# Altium project US29080671(A).PrjPCB (part 10 of 10)
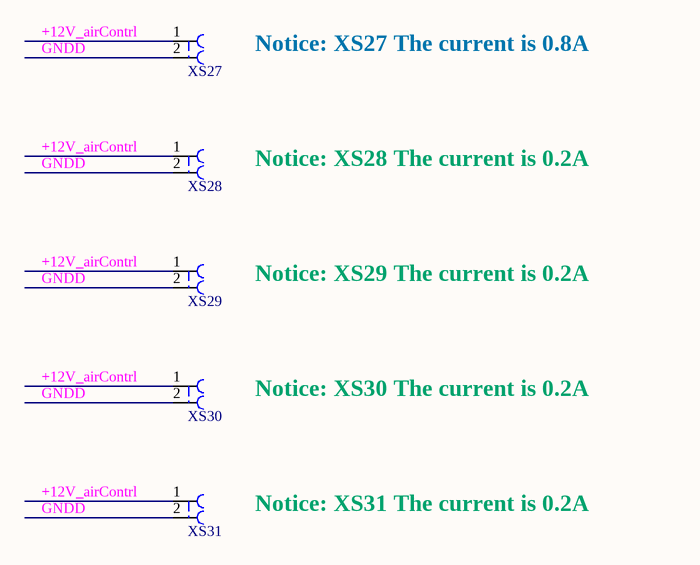
[diagram p44: MY_beamControl_R_风扇供电接口.SchDoc]

## Nets that join several sheets (continued)
D15_A_3: A7_FUNCTION2 (D2.J26), MY_beamControl_R_对内接口 (XS5.43)
D15_A_4: A7_FUNCTION1 (D2.AJ28), MY_beamControl_R_对内接口 (XS7.43)
D15_A_5: A7_FUNCTION2 (D2.AM10), MY_beamControl_R_对内接口 (XS9.43)
D15_A_6: A7_FUNCTION2 (D2.AF2), MY_beamControl_R_对内接口 (XS11.43)
D15_A_7: A7_FUNCTION3 (D2.M2), MY_beamControl_R_对内接口 (XS13.43)
D15_A_8: A7_FUNCTION2 - Ⅱ (D3.J26), MY_beamControl_R_对内接口 (XS15.43)
D15_A_9: A7_FUNCTION1 -Ⅱ (D3.AJ28), MY_beamControl_R_对内接口 (XS17.43)
D15_A_10: A7_FUNCTION2 - Ⅱ (D3.AN6), MY_beamControl_R_对内接口 (XS19.43)
D15_A_11: A7_FUNCTION3 - Ⅱ (D3.M2), MY_beamControl_R_对内接口 (XS21.43)
D15_A_12: A7_FUNCTION3 - Ⅱ (D3.Y6), MY_beamControl_R_对内接口 (XS23.43)
D15_B_1: Z7_FUNCTION3 (D1.P29), MY_beamControl_R_对内接口 (XS1.12)
D15_B_2: Z7_FUNCTION2 (D1.AH17), MY_beamControl_R_对内接口 (XS3.12)
D15_B_3: A7_FUNCTION2 (D2.J23), MY_beamControl_R_对内接口 (XS5.12)
D15_B_4: A7_FUNCTION1 (D2.AF33), MY_beamControl_R_对内接口 (XS7.12)
D15_B_5: A7_FUNCTION1 (D2.AG27), MY_beamControl_R_对内接口 (XS9.12)
D15_B_6: A7_FUNCTION2 (D2.AF4), MY_beamControl_R_对内接口 (XS11.12)
D15_B_7: A7_FUNCTION3 (D2.G4), MY_beamControl_R_对内接口 (XS13.12)
D15_B_8: A7_FUNCTION2 - Ⅱ (D3.J23), MY_beamControl_R_对内接口 (XS15.12)
D15_B_9: A7_FUNCTION1 -Ⅱ (D3.AH34), MY_beamControl_R_对内接口 (XS17.12)
D15_B_10: A7_FUNCTION2 - Ⅱ (D3.AK10), MY_beamControl_R_对内接口 (XS19.12)
D15_B_11: A7_FUNCTION3 - Ⅱ (D3.G4), MY_beamControl_R_对内接口 (XS21.12)
D15_B_12: A7_FUNCTION3 - Ⅱ (D3.W1), MY_beamControl_R_对内接口 (XS23.12)
D15_C_1: Z7_FUNCTION3 (D1.AB26), MY_beamControl_R_对内接口 (XS2.46)
D15_C_2: Z7_FUNCTION2 (D1.AG21), MY_beamControl_R_对内接口 (XS4.46)
D15_C_3: A7_FUNCTION2 (D2.L30), MY_beamControl_R_对内接口 (XS6.46)
D15_C_4: A7_FUNCTION1 (D2.AF32), MY_beamControl_R_对内接口 (XS8.46)
D15_C_5: A7_FUNCTION2 (D2.AM9), MY_beamControl_R_对内接口 (XS10.46)
D15_C_6: A7_FUNCTION2 (D2.AG10), MY_beamControl_R_对内接口 (XS12.46)
D15_C_7: A7_FUNCTION3 (D2.N8), MY_beamControl_R_对内接口 (XS14.46)
D15_C_8: A7_FUNCTION2 - Ⅱ (D3.L30), MY_beamControl_R_对内接口 (XS16.46)
D15_C_9: A7_FUNCTION1 -Ⅱ (D3.AE32), MY_beamControl_R_对内接口 (XS18.46)
D15_C_10: A7_FUNCTION1 -Ⅱ (D3.AK27), MY_beamControl_R_对内接口 (XS20.46)
D15_C_11: A7_FUNCTION3 - Ⅱ (D3.P8), MY_beamControl_R_对内接口 (XS22.46)
D15_C_12: A7_FUNCTION2 - Ⅱ (D3.AJ5), MY_beamControl_R_对内接口 (XS24.46)
D15_D_1: Z7_FUNCTION3 (D1.AG27), MY_beamControl_R_对内接口 (XS2.2)
D15_D_2: Z7_FUNCTION2 (D1.AK17), MY_beamControl_R_对内接口 (XS4.2)
D15_D_3: A7_FUNCTION2 (D2.L33), MY_beamControl_R_对内接口 (XS6.2)
D15_D_4: A7_FUNCTION1 (D2.AN31), MY_beamControl_R_对内接口 (XS8.2)
D15_D_5: A7_FUNCTION2 (D2.AN1), MY_beamControl_R_对内接口 (XS10.2)
D15_D_6: A7_FUNCTION3 (D2.AC1), MY_beamControl_R_对内接口 (XS12.2)
D15_D_7: A7_FUNCTION3 (D2.L4), MY_beamControl_R_对内接口 (XS14.2)
D15_D_8: A7_FUNCTION2 - Ⅱ (D3.L33), MY_beamControl_R_对内接口 (XS16.2)
D15_D_9: A7_FUNCTION1 -Ⅱ (D3.AH32), MY_beamControl_R_对内接口 (XS18.2)
D15_D_10: A7_FUNCTION1 -Ⅱ (D3.AN27), MY_beamControl_R_对内接口 (XS20.2)
D15_D_11: A7_FUNCTION3 - Ⅱ (D3.L4), MY_beamControl_R_对内接口 (XS22.2)
D15_D_12: A7_FUNCTION2 - Ⅱ (D3.AG12), MY_beamControl_R_对内接口 (XS24.2)
D16_A_1: Z7_FUNCTION3 (D1.Y30), MY_beamControl_R_对内接口 (XS1.19)
D16_A_2: Z7_FUNCTION2 (D1.AD15), MY_beamControl_R_对内接口 (XS3.19)
D16_A_3: A7_FUNCTION2 (D2.K25), MY_beamControl_R_对内接口 (XS5.19)
D16_A_4: A7_FUNCTION1 (D2.U30), MY_beamControl_R_对内接口 (XS7.19)
D16_A_5: A7_FUNCTION2 (D2.AP10), MY_beamControl_R_对内接口 (XS9.19)
D16_A_6: A7_FUNCTION3 (D2.W1), MY_beamControl_R_对内接口 (XS11.19)
D16_A_7: A7_FUNCTION3 (D2.P3), MY_beamControl_R_对内接口 (XS13.19)
D16_A_8: A7_FUNCTION2 - Ⅱ (D3.K25), MY_beamControl_R_对内接口 (XS15.19)
D16_A_9: A7_FUNCTION1 -Ⅱ (D3.U30), MY_beamControl_R_对内接口 (XS17.19)
D16_A_10: A7_FUNCTION2 - Ⅱ (D3.AP6), MY_beamControl_R_对内接口 (XS19.19)
D16_A_11: A7_FUNCTION3 - Ⅱ (D3.P3), MY_beamControl_R_对内接口 (XS21.19)
D16_A_12: A7_FUNCTION2 - Ⅱ (D3.AD1), MY_beamControl_R_对内接口 (XS23.19)
D16_B_1: Z7_FUNCTION3 (D1.N28), MY_beamControl_R_对内接口 (XS1.50)
D16_B_2: Z7_FUNCTION2 (D1.AG15), MY_beamControl_R_对内接口 (XS3.50)
D16_B_3: A7_FUNCTION1 (D2.T27), MY_beamControl_R_对内接口 (XS5.50)
D16_B_4: A7_FUNCTION1 (D2.N31), MY_beamControl_R_对内接口 (XS7.50)
D16_B_5: A7_FUNCTION1 (D2.AN29), MY_beamControl_R_对内接口 (XS9.50)
D16_B_6: A7_FUNCTION2 (D2.AK3), MY_beamControl_R_对内接口 (XS11.50)
D16_B_7: A7_FUNCTION3 (D2.F2), MY_beamControl_R_对内接口 (XS13.50)
D16_B_8: A7_FUNCTION1 -Ⅱ (D3.T27), MY_beamControl_R_对内接口 (XS15.50)
D16_B_9: A7_FUNCTION1 -Ⅱ (D3.N31), MY_beamControl_R_对内接口 (XS17.50)
D16_B_10: A7_FUNCTION1 -Ⅱ (D3.AP25), MY_beamControl_R_对内接口 (XS19.50)
D16_B_11: A7_FUNCTION3 - Ⅱ (D3.F2), MY_beamControl_R_对内接口 (XS21.50)
D16_B_12: A7_FUNCTION3 - Ⅱ (D3.AB4), MY_beamControl_R_对内接口 (XS23.50)
D16_C_1: Z7_FUNCTION3 (D1.AG29), MY_beamControl_R_对内接口 (XS2.20)
D16_C_2: Z7_FUNCTION2 (D1.AF20), MY_beamControl_R_对内接口 (XS4.20)
D16_C_3: A7_FUNCTION1 (D2.T28), MY_beamControl_R_对内接口 (XS6.20)
D16_C_4: A7_FUNCTION1 (D2.AG31), MY_beamControl_R_对内接口 (XS8.20)
D16_C_5: A7_FUNCTION1 (D2.AD24), MY_beamControl_R_对内接口 (XS10.20)
D16_C_6: A7_FUNCTION2 (D2.AH9), MY_beamControl_R_对内接口 (XS12.20)
D16_C_7: A7_FUNCTION3 (D2.J9), MY_beamControl_R_对内接口 (XS14.20)
D16_C_8: A7_FUNCTION1 -Ⅱ (D3.T28), MY_beamControl_R_对内接口 (XS16.20)
D16_C_9: A7_FUNCTION1 -Ⅱ (D3.AE28), MY_beamControl_R_对内接口 (XS18.20)
D16_C_10: A7_FUNCTION1 -Ⅱ (D3.AD24), MY_beamControl_R_对内接口 (XS20.20)
D16_C_11: A7_FUNCTION3 - Ⅱ (D3.J9), MY_beamControl_R_对内接口 (XS22.20)
D16_C_12: A7_FUNCTION2 - Ⅱ (D3.AF8), MY_beamControl_R_对内接口 (XS24.20)
D16_D_1: Z7_FUNCTION3 (D1.AE25), MY_beamControl_R_对内接口 (XS2.39)
D16_D_2: Z7_FUNCTION2 (D1.AJ18), MY_beamControl_R_对内接口 (XS4.39)
D16_D_3: A7_FUNCTION1 (D2.N32), MY_beamControl_R_对内接口 (XS6.39)
D16_D_4: A7_FUNCTION1 (D2.AK30), MY_beamControl_R_对内接口 (XS8.39)
D16_D_5: A7_FUNCTION2 (D2.AK6), MY_beamControl_R_对内接口 (XS10.39)
D16_D_6: A7_FUNCTION2 (D2.AJ4), MY_beamControl_R_对内接口 (XS12.39)
D16_D_7: A7_FUNCTION3 (D2.J11), MY_beamControl_R_对内接口 (XS14.39)
D16_D_8: A7_FUNCTION1 -Ⅱ (D3.N32), MY_beamControl_R_对内接口 (XS16.39)
D16_D_9: A7_FUNCTION1 -Ⅱ (D3.AL30), MY_beamControl_R_对内接口 (XS18.39)
D16_D_10: A7_FUNCTION2 - Ⅱ (D3.AK11), MY_beamControl_R_对内接口 (XS20.39)
D16_D_11: A7_FUNCTION3 - Ⅱ (D3.M4), MY_beamControl_R_对内接口 (XS22.39)
D16_D_12: A7_FUNCTION2 - Ⅱ (D3.AG4), MY_beamControl_R_对内接口 (XS24.39)
DDR_A0: Z7_BANK_DDR3 (D1.L25 R143.1), Z7_DDR3 (D9.N3 D10.N3)
DDR_A1: Z7_BANK_DDR3 (D1.K26 R144.1), Z7_DDR3 (D9.P7 D10.P7)
DDR_A2: Z7_BANK_DDR3 (D1.L27 R145.1), Z7_DDR3 (D9.P3 D10.P3)
DDR_A3: Z7_BANK_DDR3 (D1.G25 R146.1), Z7_DDR3 (D9.N2 D10.N2)
DDR_A4: Z7_BANK_DDR3 (D1.J26 R147.1), Z7_DDR3 (D9.P8 D10.P8)
DDR_A5: Z7_BANK_DDR3 (D1.G24 R148.1), Z7_DDR3 (D9.P2 D10.P2)
DDR_A6: Z7_BANK_DDR3 (D1.H26 R149.1), Z7_DDR3 (D9.R8 D10.R8)
DDR_A7: Z7_BANK_DDR3 (D1.K22 R150.1), Z7_DDR3 (D9.R2 D10.R2)
DDR_A8: Z7_BANK_DDR3 (D1.F27 R151.1), Z7_DDR3 (D9.T8 D10.T8)
DDR_A9: Z7_BANK_DDR3 (D1.J23 R152.1), Z7_DDR3 (D9.R3 D10.R3)
DDR_A10: Z7_BANK_DDR3 (D1.G26 R153.1), Z7_DDR3 (D9.L7 D10.L7)
DDR_A11: Z7_BANK_DDR3 (D1.H24 R154.1), Z7_DDR3 (D9.R7 D10.R7)
DDR_A12: Z7_BANK_DDR3 (D1.K23 R155.1), Z7_DDR3 (D9.N7 D10.N7)
DDR_A13: Z7_BANK_DDR3 (D1.H23 R156.1), Z7_DDR3 (D9.T3 D10.T3)
DDR_A14: Z7_BANK_DDR3 (D1.J24 R157.1), Z7_DDR3 (D9.T7 D10.T7)
DDR_BA0: Z7_BANK_DDR3 (D1.M27 R159.1), Z7_DDR3 (D9.M2 D10.M2)
DDR_BA1: Z7_BANK_DDR3 (D1.M26 R160.1), Z7_DDR3 (D9.N8 D10.N8)
DDR_BA2: Z7_BANK_DDR3 (D1.M25 R161.1), Z7_DDR3 (D9.M3 D10.M3)
DDR_CAS_N: Z7_BANK_DDR3 (D1.M24 R163.1), Z7_DDR3 (D9.K3 D10.K3)
DDR_CKE: Z7_BANK_DDR3 (D1.M22 R165.1 R350.2), Z7_DDR3 (D9.K9 D10.K9)
DDR_CLKN: Z7_BANK_DDR3 (D1.J25), Z7_DDR3 (D9.K7 D10.K7 R175.1)
DDR_CLKP: Z7_BANK_DDR3 (D1.K25), Z7_DDR3 (D9.J7 D10.J7 R175.2)
DDR_CS_N: Z7_BANK_DDR3 (D1.N22 R169.1), Z7_DDR3 (D9.L2 D10.L2)
DDR_DQ0: Z7_BANK_DDR3 (D1.A25), Z7_DDR3 (D10.E3)
DDR_DQ1: Z7_BANK_DDR3 (D1.E25), Z7_DDR3 (D10.F7)
DDR_DQ2: Z7_BANK_DDR3 (D1.B27), Z7_DDR3 (D10.F2)
DDR_DQ3: Z7_BANK_DDR3 (D1.D25), Z7_DDR3 (D10.F8)
DDR_DQ4: Z7_BANK_DDR3 (D1.B25), Z7_DDR3 (D10.H3)
DDR_DQ5: Z7_BANK_DDR3 (D1.E26), Z7_DDR3 (D10.H8)
DDR_DQ6: Z7_BANK_DDR3 (D1.D26), Z7_DDR3 (D10.G2)
DDR_DQ7: Z7_BANK_DDR3 (D1.E27), Z7_DDR3 (D10.H7)
DDR_DQ8: Z7_BANK_DDR3 (D1.A29), Z7_DDR3 (D10.D7)
DDR_DQ9: Z7_BANK_DDR3 (D1.A27), Z7_DDR3 (D10.C3)
DDR_DQ10: Z7_BANK_DDR3 (D1.A30), Z7_DDR3 (D10.C8)
DDR_DQ11: Z7_BANK_DDR3 (D1.A28), Z7_DDR3 (D10.C2)
DDR_DQ12: Z7_BANK_DDR3 (D1.C28), Z7_DDR3 (D10.A7)
DDR_DQ13: Z7_BANK_DDR3 (D1.D30), Z7_DDR3 (D10.A2)
DDR_DQ14: Z7_BANK_DDR3 (D1.D28), Z7_DDR3 (D10.B8)
DDR_DQ15: Z7_BANK_DDR3 (D1.D29), Z7_DDR3 (D10.A3)
DDR_DQ16: Z7_BANK_DDR3 (D1.H27), Z7_DDR3 (D9.E3)
DDR_DQ17: Z7_BANK_DDR3 (D1.G27), Z7_DDR3 (D9.F7)
DDR_DQ18: Z7_BANK_DDR3 (D1.H28), Z7_DDR3 (D9.F2)
DDR_DQ19: Z7_BANK_DDR3 (D1.E28), Z7_DDR3 (D9.F8)
DDR_DQ20: Z7_BANK_DDR3 (D1.E30), Z7_DDR3 (D9.H3)
DDR_DQ21: Z7_BANK_DDR3 (D1.F28), Z7_DDR3 (D9.H8)
DDR_DQ22: Z7_BANK_DDR3 (D1.G30), Z7_DDR3 (D9.G2)
DDR_DQ23: Z7_BANK_DDR3 (D1.F30), Z7_DDR3 (D9.H7)
DDR_DQ24: Z7_BANK_DDR3 (D1.J29), Z7_DDR3 (D9.D7)
DDR_DQ25: Z7_BANK_DDR3 (D1.K27), Z7_DDR3 (D9.C3)
DDR_DQ26: Z7_BANK_DDR3 (D1.J30), Z7_DDR3 (D9.C8)
DDR_DQ27: Z7_BANK_DDR3 (D1.J28), Z7_DDR3 (D9.C2)
DDR_DQ28: Z7_BANK_DDR3 (D1.K30), Z7_DDR3 (D9.A7)
DDR_DQ29: Z7_BANK_DDR3 (D1.M29), Z7_DDR3 (D9.A2)
DDR_DQ30: Z7_BANK_DDR3 (D1.L30), Z7_DDR3 (D9.B8)
DDR_DQ31: Z7_BANK_DDR3 (D1.M30), Z7_DDR3 (D9.A3)
DDR_DQM0: Z7_BANK_DDR3 (D1.C27), Z7_DDR3 (D10.E7)
DDR_DQM1: Z7_BANK_DDR3 (D1.B30), Z7_DDR3 (D10.D3)
DDR_DQM2: Z7_BANK_DDR3 (D1.H29), Z7_DDR3 (D9.E7)
DDR_DQM3: Z7_BANK_DDR3 (D1.K28), Z7_DDR3 (D9.D3)
DDR_DQSN0: Z7_BANK_DDR3 (D1.B26), Z7_DDR3 (D10.G3)
DDR_DQSN1: Z7_BANK_DDR3 (D1.B29), Z7_DDR3 (D10.B7)
DDR_DQSN2: Z7_BANK_DDR3 (D1.F29), Z7_DDR3 (D9.G3)
DDR_DQSN3: Z7_BANK_DDR3 (D1.L29), Z7_DDR3 (D9.B7)
DDR_DQSP0: Z7_BANK_DDR3 (D1.C26), Z7_DDR3 (D10.F3)
DDR_DQSP1: Z7_BANK_DDR3 (D1.C29), Z7_DDR3 (D10.C7)
DDR_DQSP2: Z7_BANK_DDR3 (D1.G29), Z7_DDR3 (D9.F3)
DDR_DQSP3: Z7_BANK_DDR3 (D1.L28), Z7_DDR3 (D9.C7)
DDR_ODT: Z7_BANK_DDR3 (D1.L23 R167.1), Z7_DDR3 (D9.K1 D10.K1)
DDR_RAS_N: Z7_BANK_DDR3 (D1.N24 R162.1), Z7_DDR3 (D9.J3 D10.J3)
DDR_RESET_N: Z7_BANK_DDR3 (D1.F25 R158.2 R168.1), Z7_DDR3 (D9.T2 D10.T2)
DDR_WE_N: Z7_BANK_DDR3 (D1.N23 R170.1), Z7_DDR3 (D9.L3 D10.L3)
EMMC_RST_N: Z7_STORAGE (D19.U5 R274.2), Z7_FUNCTION1 (D1.F7)
ENET0_INT: Z7_ETHERNET (D11.5 R183.1), Z7_FUNCTION3 (D1.P21)
ENET0_MDC: Z7_BANK500_501 (D1.D19), Z7_ETHERNET (D23.4 R288.1)
ENET0_MDIO: Z7_BANK500_501 (D1.C18), Z7_ETHERNET (D23.5 R287.1)
ENET0_PHY_RSTN: Z7_ETHERNET (R182.1), Z7_FUNCTION3 (D1.R21)
ENET0_RX_CLK: Z7_BANK500_501 (D1.L20), Z7_ETHERNET (R192.1 R339.1)
ENET0_RX_CTL: Z7_BANK500_501 (D1.G20), Z7_ETHERNET (R195.1 R344.1)
ENET0_RXD0: Z7_BANK500_501 (D1.J21), Z7_ETHERNET (R188.1 R340.1)
ENET0_RXD1: Z7_BANK500_501 (D1.M19), Z7_ETHERNET (R189.1 R341.1)
ENET0_RXD2: Z7_BANK500_501 (D1.G19), Z7_ETHERNET (R190.1 R342.1)
ENET0_RXD3: Z7_BANK500_501 (D1.M17), Z7_ETHERNET (R191.1 R343.1)
ENET0_TX_CLK: Z7_BANK500_501 (D1.L19), Z7_ETHERNET (R176.1)
ENET0_TX_CTL: Z7_BANK500_501 (D1.J19), Z7_ETHERNET (R338.1)
ENET0_TXD0: Z7_BANK500_501 (D1.K21), Z7_ETHERNET (R251.1)
ENET0_TXD1: Z7_BANK500_501 (D1.K20), Z7_ETHERNET (R253.1)
ENET0_TXD2: Z7_BANK500_501 (D1.J20), Z7_ETHERNET (R317.1)
ENET0_TXD3: Z7_BANK500_501 (D1.M20), Z7_ETHERNET (R337.1)
FPGA0_CFG_RW: A7_JTAG&CONFIG (D2.AC33), Z7_FUNCTION2 (D1.AC22)
FPGA0_CSI_N: A7_JTAG&CONFIG (D2.AA32), Z7_FUNCTION2 (D1.AC23)
FPGA0_DONE: A7_JTAG&CONFIG (D2.P11 R13.1), Z7_FUNCTION2 (D1.AA23)
FPGA0_INIT_N: A7_JTAG&CONFIG (D2.V11 R324.1), Z7_FUNCTION2 (D1.AA22)
FPGA0_PRG_N: A7_JTAG&CONFIG (D2.N11 R325.1), Z7_FUNCTION2 (D1.AB24)
FPGA0_RST: A7_FUNCTION2 (D2.AK7), Z7_FUNCTION2 (D1.AC13)
FPGA0_TDI_R: A7_JTAG&CONFIG (D2.AE14), Z7_BLOCK (R292.1), Z7_JTAG&DEBUG (R302.1)
FPGA0_TDO: A7_JTAG&CONFIG (D2.AD13 R296.2), Z7_BLOCK (R295.1)
FPGA1_CCLK: A7_JTAG&CONFIG - Ⅱ (D3.W11), Z7_FUNCTION2 (D1.AH13)
FPGA1_CFG_RW: A7_JTAG&CONFIG - Ⅱ (D3.AC33), Z7_FUNCTION3 (D1.AK26)
FPGA1_CSI_N: A7_JTAG&CONFIG - Ⅱ (D3.AA32), Z7_FUNCTION3 (D1.AA25)
FPGA1_DONE: A7_JTAG&CONFIG - Ⅱ (D3.P11 R9.1), Z7_FUNCTION3 (D1.AJ26)
FPGA1_INIT_N: A7_JTAG&CONFIG - Ⅱ (D3.V11 R326.1), Z7_FUNCTION3 (D1.AH27)
FPGA1_PRG_N: A7_JTAG&CONFIG - Ⅱ (D3.N11 R327.1), Z7_FUNCTION3 (D1.AH26)
FPGA1_RST: A7_FUNCTION2 - Ⅱ (D3.AD6), Z7_FUNCTION2 (D1.AA15)
FPGA1_TDI_R: A7_JTAG&CONFIG (R296.1), A7_JTAG&CONFIG - Ⅱ (D3.AE14), Z7_BLOCK (R293.1)
FPGA1_TDO: A7_JTAG&CONFIG - Ⅱ (D3.AD13), Z7_BLOCK (R303.1)
FPGA_CCLK: A7_JTAG&CONFIG (D2.W11), Z7_FUNCTION2 (D1.AC21)
FPGA_CFG_D0: A7_JTAG&CONFIG (D2.V28), A7_JTAG&CONFIG - Ⅱ (D3.V28), Z7_FUNCTION2 (D1.AA17)
FPGA_CFG_D1: A7_JTAG&CONFIG (D2.V29), A7_JTAG&CONFIG - Ⅱ (D3.V29), Z7_FUNCTION2 (D1.AB16)
FPGA_CFG_D2: A7_JTAG&CONFIG (D2.V26), A7_JTAG&CONFIG - Ⅱ (D3.V26), Z7_FUNCTION2 (D1.AB17)
FPGA_CFG_D3: A7_JTAG&CONFIG (D2.V27), A7_JTAG&CONFIG - Ⅱ (D3.V27), Z7_FUNCTION2 (D1.AC16)
FPGA_CFG_D4: A7_JTAG&CONFIG (D2.W28), A7_JTAG&CONFIG - Ⅱ (D3.W28), Z7_FUNCTION2 (D1.AC17)
FPGA_CFG_D5: A7_JTAG&CONFIG (D2.W29), A7_JTAG&CONFIG - Ⅱ (D3.W29), Z7_FUNCTION2 (D1.AB14)
FPGA_CFG_D6: A7_JTAG&CONFIG (D2.W25), A7_JTAG&CONFIG - Ⅱ (D3.W25), Z7_FUNCTION2 (D1.AB15)
FPGA_CFG_D7: A7_JTAG&CONFIG (D2.Y25), A7_JTAG&CONFIG - Ⅱ (D3.Y25), Z7_FUNCTION2 (D1.AC12)
JC_RS422_TX+: Z7_FUNCTION2 (D12.9 R200.2), MY_beamControl_R_对外接口 (XS26.4)
JC_RS422_TX-: Z7_FUNCTION2 (D12.10 R200.1), MY_beamControl_R_对外接口 (XS26.5)
JTAG_TCK: A7_JTAG&CONFIG (D2.AE12), A7_JTAG&CONFIG - Ⅱ (D3.AE12), Z7_BLOCK (JTAG1.6), Z7_JTAG&DEBUG (D1.Y12 R209.2)
JTAG_TMS: A7_JTAG&CONFIG (D2.AE13), A7_JTAG&CONFIG - Ⅱ (D3.AE13), Z7_BLOCK (JTAG1.4), Z7_JTAG&DEBUG (D1.V10 R208.2)
KZ_RS422_RX+: Z7_FUNCTION2 (D12.11), MY_beamControl_R_对外接口 (XS26.8)
KZ_RS422_RX-: Z7_FUNCTION2 (D12.12), MY_beamControl_R_对外接口 (XS26.9)
LD_A_1: Z7_FUNCTION3 (D1.W26), MY_beamControl_R_对内接口 (XS1.28)
LD_A_2: Z7_FUNCTION2 (D1.AE17), MY_beamControl_R_对内接口 (XS3.28)
LD_A_3: A7_FUNCTION2 (D2.K28), MY_beamControl_R_对内接口 (XS5.28)
LD_A_4: A7_FUNCTION1 (D2.AD28), MY_beamControl_R_对内接口 (XS7.28)
LD_A_5: A7_FUNCTION2 (D2.AN7), MY_beamControl_R_对内接口 (XS9.28)
LD_A_6: A7_FUNCTION3 (D2.AC2), MY_beamControl_R_对内接口 (XS11.28)
LD_A_7: A7_FUNCTION3 (D2.R2), MY_beamControl_R_对内接口 (XS13.28)
LD_A_8: A7_FUNCTION2 - Ⅱ (D3.K28), MY_beamControl_R_对内接口 (XS15.28)
LD_A_9: A7_FUNCTION1 -Ⅱ (D3.AM32), MY_beamControl_R_对内接口 (XS17.28)
LD_A_10: A7_FUNCTION2 - Ⅱ (D3.AN2), MY_beamControl_R_对内接口 (XS19.28)
LD_A_11: A7_FUNCTION3 - Ⅱ (D3.P1), MY_beamControl_R_对内接口 (XS21.28)
LD_A_12: A7_FUNCTION3 - Ⅱ (D3.V7), MY_beamControl_R_对内接口 (XS23.28)
LD_B_1: Z7_FUNCTION3 (D1.U29), MY_beamControl_R_对内接口 (XS1.22)
LD_B_2: Z7_FUNCTION2 (D1.AJ15), MY_beamControl_R_对内接口 (XS3.22)
LD_B_3: A7_FUNCTION1 (D2.R25), MY_beamControl_R_对内接口 (XS5.22)
LD_B_4: A7_FUNCTION1 (D2.U34), MY_beamControl_R_对内接口 (XS7.22)
LD_B_5: A7_FUNCTION1 (D2.AM27), MY_beamControl_R_对内接口 (XS9.22)
LD_B_6: A7_FUNCTION3 (D2.AA3), MY_beamControl_R_对内接口 (XS11.22)
LD_B_7: A7_FUNCTION3 (D2.L3), MY_beamControl_R_对内接口 (XS13.22)
LD_B_8: A7_FUNCTION1 -Ⅱ (D3.R25), MY_beamControl_R_对内接口 (XS15.22)
LD_B_9: A7_FUNCTION1 -Ⅱ (D3.AL34), MY_beamControl_R_对内接口 (XS17.22)
LD_B_10: A7_FUNCTION2 - Ⅱ (D3.AK8), MY_beamControl_R_对内接口 (XS19.22)
LD_B_11: A7_FUNCTION3 - Ⅱ (D3.L3), MY_beamControl_R_对内接口 (XS21.22)
LD_B_12: A7_FUNCTION3 - Ⅱ (D3.AB1), MY_beamControl_R_对内接口 (XS23.22)
LD_C_1: Z7_FUNCTION3 (D1.T25), MY_beamControl_R_对内接口 (XS2.36)
LD_C_2: Z7_FUNCTION2 (D1.AF22), MY_beamControl_R_对内接口 (XS4.36)
LD_C_3: A7_FUNCTION2 (D2.H31), MY_beamControl_R_对内接口 (XS6.36)
LD_C_4: A7_FUNCTION1 (D2.AE32), MY_beamControl_R_对内接口 (XS8.36)
LD_C_5: A7_FUNCTION2 (D2.AJ11), MY_beamControl_R_对内接口 (XS10.36)
LD_C_6: A7_FUNCTION2 (D2.AE11), MY_beamControl_R_对内接口 (XS12.36)
LD_C_7: A7_FUNCTION3 (D2.P5), MY_beamControl_R_对内接口 (XS14.36)
LD_C_8: A7_FUNCTION2 - Ⅱ (D3.H31), MY_beamControl_R_对内接口 (XS16.36)
LD_C_9: A7_FUNCTION1 -Ⅱ (D3.AC26), MY_beamControl_R_对内接口 (XS18.36)
LD_C_10: A7_FUNCTION1 -Ⅱ (D3.AH27), MY_beamControl_R_对内接口 (XS20.36)
LD_C_11: A7_FUNCTION3 - Ⅱ (D3.K11), MY_beamControl_R_对内接口 (XS22.36)
LD_C_12: A7_FUNCTION2 - Ⅱ (D3.AG2), MY_beamControl_R_对内接口 (XS24.36)
LD_D_1: Z7_FUNCTION3 (D1.AK30), MY_beamControl_R_对内接口 (XS2.17)
LD_D_2: Z7_FUNCTION2 (D1.AH18), MY_beamControl_R_对内接口 (XS4.17)
LD_D_3: A7_FUNCTION1 (D2.U25), MY_beamControl_R_对内接口 (XS6.17)
LD_D_4: A7_FUNCTION1 (D2.AM31), MY_beamControl_R_对内接口 (XS8.17)
LD_D_5: A7_FUNCTION2 (D2.AN4), MY_beamControl_R_对内接口 (XS10.17)
LD_D_6: A7_FUNCTION2 (D2.AH1), MY_beamControl_R_对内接口 (XS12.17)
LD_D_7: A7_FUNCTION3 (D2.H7), MY_beamControl_R_对内接口 (XS14.17)
LD_D_8: A7_FUNCTION1 -Ⅱ (D3.U25), MY_beamControl_R_对内接口 (XS16.17)
LD_D_9: A7_FUNCTION1 -Ⅱ (D3.AG31), MY_beamControl_R_对内接口 (XS18.17)
LD_D_10: A7_FUNCTION1 -Ⅱ (D3.AN29), MY_beamControl_R_对内接口 (XS20.17)
LD_D_11: A7_FUNCTION3 - Ⅱ (D3.H7), MY_beamControl_R_对内接口 (XS22.17)
LD_D_12: A7_FUNCTION2 - Ⅱ (D3.AH9), MY_beamControl_R_对内接口 (XS24.17)
POW_SYS_PG: POWER_B3 (D6.6 R105.1), ZYNQ_reset (D26.1)
PS_POR_N: Z7_BANK500_501 (C269.1 D1.D21 R131.1 R140.2), Z7_FUNCTION1 (D1.J3), ZYNQ_reset (D26.4)
PS_SRST_N: Z7_BANK500_501 (D1.B19 R130.1), Z7_FUNCTION1 (D1.H9)
QSPI0_0: Z7_BANK500_501 (D1.F23 R139.2), Z7_STORAGE (D16.5)
QSPI0_1: Z7_BANK500_501 (D1.C23 R138.2), Z7_STORAGE (D16.2)
QSPI0_2: Z7_BANK500_501 (D1.E23 R4.1 R137.2), Z7_STORAGE (D16.3)
QSPI0_3: Z7_BANK500_501 (D1.C24 R5.1), Z7_STORAGE (D16.7)
QSPI0_SCLK: Z7_BANK500_501 (D1.D24 R136.2), Z7_STORAGE (D16.6)
QSPI0_SS_B: Z7_BANK500_501 (D1.D23), Z7_STORAGE (D16.1)
QSPI1_0: Z7_BANK500_501 (D1.E22), Z7_STORAGE (D18.5)
QSPI1_1: Z7_BANK500_501 (D1.A23), Z7_STORAGE (D18.2)
QSPI1_2: Z7_BANK500_501 (D1.E21), Z7_STORAGE (D18.3)
QSPI1_3: Z7_BANK500_501 (D1.F22), Z7_STORAGE (D18.7)
QSPI1_SCLK: Z7_BANK500_501 (D1.A24), Z7_STORAGE (D18.6)
QSPI1_SS_B: Z7_BANK500_501 (D1.F24), Z7_STORAGE (D18.1)
RX1: Z7_FUNCTION2 (D1.AC24), MY_beamControl_R_对外接口 (D24.2)
SD0_CLK: Z7_BANK500_501 (D1.B20), Z7_STORAGE (D17.9)
SD0_CMD: Z7_BANK500_501 (D1.J18), Z7_STORAGE (D17.4)
SD0_DATA0: Z7_BANK500_501 (D1.D20), Z7_STORAGE (D17.6)
SD0_DATA1: Z7_BANK500_501 (D1.E18), Z7_STORAGE (D17.7)
SD0_DATA2: Z7_BANK500_501 (D1.E20), Z7_STORAGE (D17.1)
SD0_DATA3: Z7_BANK500_501 (D1.H18), Z7_STORAGE (D17.3)
SD0_SEL: Z7_STORAGE (D17.24 R260.1 R261.2), Z7_FUNCTION1 (D1.J4)
SD1_CLK: Z7_BANK500_501 (D1.C19), Z7_STORAGE (R272.1)
SD1_CMD: Z7_BANK500_501 (D1.A18), Z7_STORAGE (R273.1)
SD1_DATA0: Z7_BANK500_501 (D1.F20), Z7_STORAGE (R262.1)
SD1_DATA1: Z7_BANK500_501 (D1.D18), Z7_STORAGE (R264.1)
SD1_DATA2: Z7_BANK500_501 (D1.A19), Z7_STORAGE (R266.1)
SD1_DATA3: Z7_BANK500_501 (D1.F19), Z7_STORAGE (R268.1)
SUBA1_DLY0: Z7_FUNCTION1 (D1.L3), MY_beamControl_R电平转换 (U1.C5)
SUBA1_DLY1: Z7_FUNCTION1 (D1.K2), MY_beamControl_R电平转换 (U1.B6)
SUBA1_DLY2: Z7_FUNCTION1 (D1.K3), MY_beamControl_R电平转换 (U1.B5)
SUBA1_DLY_5V0: MY_beamControl_R_对内接口 (XS2.50), MY_beamControl_R电平转换 (U1.C2)
SUBA1_DLY_5V1: MY_beamControl_R_对内接口 (XS2.33), MY_beamControl_R电平转换 (U1.B1)
SUBA1_DLY_5V2: MY_beamControl_R_对内接口 (XS2.6), MY_beamControl_R电平转换 (U1.B2)
SUBA2_DLY0: Z7_FUNCTION1 (D1.J5), MY_beamControl_R电平转换 (U1.D6)
SUBA2_DLY1: Z7_FUNCTION1 (D1.K5), MY_beamControl_R电平转换 (U1.D5)
SUBA2_DLY2: Z7_FUNCTION1 (D1.L2), MY_beamControl_R电平转换 (U1.C6)
SUBA2_DLY_5V0: MY_beamControl_R_对内接口 (XS4.50), MY_beamControl_R电平转换 (U1.D1)
SUBA2_DLY_5V1: MY_beamControl_R_对内接口 (XS4.33), MY_beamControl_R电平转换 (U1.D2)
SUBA2_DLY_5V2: MY_beamControl_R_对内接口 (XS4.6), MY_beamControl_R电平转换 (U1.C1)
SUBA3_DLY0: Z7_FUNCTION1 (D1.G2), MY_beamControl_R电平转换 (U1.F6)
SUBA3_DLY1: Z7_FUNCTION1 (D1.J6), MY_beamControl_R电平转换 (U1.E6)
SUBA3_DLY2: Z7_FUNCTION1 (D1.K6), MY_beamControl_R电平转换 (U1.E5)
SUBA3_DLY_5V0: MY_beamControl_R_对内接口 (XS6.50), MY_beamControl_R电平转换 (U1.F1)
SUBA3_DLY_5V1: MY_beamControl_R_对内接口 (XS6.33), MY_beamControl_R电平转换 (U1.E1)
SUBA3_DLY_5V2: MY_beamControl_R_对内接口 (XS6.6), MY_beamControl_R电平转换 (U1.E2)
SUBA4_DLY0: Z7_FUNCTION1 (D1.G6), MY_beamControl_R电平转换 (U1.G5)
SUBA4_DLY1: Z7_FUNCTION1 (D1.H6), MY_beamControl_R电平转换 (U1.G6)
SUBA4_DLY2: Z7_FUNCTION1 (D1.F2), MY_beamControl_R电平转换 (U1.F5)
SUBA4_DLY_5V0: MY_beamControl_R_对内接口 (XS8.50), MY_beamControl_R电平转换 (U1.G2)
SUBA4_DLY_5V1: MY_beamControl_R_对内接口 (XS8.33), MY_beamControl_R电平转换 (U1.G1)
SUBA4_DLY_5V2: MY_beamControl_R_对内接口 (XS8.6), MY_beamControl_R电平转换 (U1.F2)
SUBA5_DLY0: Z7_FUNCTION1 (D1.H2), MY_beamControl_R电平转换 (U1.J6)
SUBA5_DLY1: Z7_FUNCTION1 (D1.H1), MY_beamControl_R电平转换 (U1.H5)
SUBA5_DLY2: Z7_FUNCTION1 (D1.J1), MY_beamControl_R电平转换 (U1.H6)
SUBA5_DLY_5V0: MY_beamControl_R_对内接口 (XS10.50), MY_beamControl_R电平转换 (U1.J1)
SUBA5_DLY_5V1: MY_beamControl_R_对内接口 (XS10.33), MY_beamControl_R电平转换 (U1.H2)
SUBA5_DLY_5V2: MY_beamControl_R_对内接口 (XS10.6), MY_beamControl_R电平转换 (U1.H1)
SUBA6_DLY0: Z7_FUNCTION1 (D1.D5), MY_beamControl_R电平转换 (U3.C5)
SUBA6_DLY1: Z7_FUNCTION1 (D1.E6), MY_beamControl_R电平转换 (U3.B6)
SUBA6_DLY2: Z7_FUNCTION1 (D1.G1), MY_beamControl_R电平转换 (U3.B5)
SUBA6_DLY_5V0: MY_beamControl_R_对内接口 (XS12.50), MY_beamControl_R电平转换 (U3.C2)
SUBA6_DLY_5V1: MY_beamControl_R_对内接口 (XS12.33), MY_beamControl_R电平转换 (U3.B1)
SUBA6_DLY_5V2: MY_beamControl_R_对内接口 (XS12.6), MY_beamControl_R电平转换 (U3.B2)
SUBA7_DLY0: Z7_FUNCTION1 (D1.E3), MY_beamControl_R电平转换 (U3.D6)
SUBA7_DLY1: Z7_FUNCTION1 (D1.D3), MY_beamControl_R电平转换 (U3.D5)
SUBA7_DLY2: Z7_FUNCTION1 (D1.D4), MY_beamControl_R电平转换 (U3.C6)
SUBA7_DLY_5V0: MY_beamControl_R_对内接口 (XS14.50), MY_beamControl_R电平转换 (U3.D1)
SUBA7_DLY_5V1: MY_beamControl_R_对内接口 (XS14.33), MY_beamControl_R电平转换 (U3.D2)
SUBA7_DLY_5V2: MY_beamControl_R_对内接口 (XS14.6), MY_beamControl_R电平转换 (U3.C1)
SUBA8_DLY0: Z7_FUNCTION1 (D1.D1), MY_beamControl_R电平转换 (U3.F6)
SUBA8_DLY1: Z7_FUNCTION1 (D1.E1), MY_beamControl_R电平转换 (U3.E6)
SUBA8_DLY2: Z7_FUNCTION1 (D1.E2), MY_beamControl_R电平转换 (U3.E5)
SUBA8_DLY_5V0: MY_beamControl_R_对内接口 (XS16.50), MY_beamControl_R电平转换 (U3.F1)
SUBA8_DLY_5V1: MY_beamControl_R_对内接口 (XS16.33), MY_beamControl_R电平转换 (U3.E1)
SUBA8_DLY_5V2: MY_beamControl_R_对内接口 (XS16.6), MY_beamControl_R电平转换 (U3.E2)
SUBA9_DLY0: Z7_FUNCTION1 (D1.B5), MY_beamControl_R电平转换 (U3.G5)
SUBA9_DLY1: Z7_FUNCTION1 (D1.C3), MY_beamControl_R电平转换 (U3.G6)
SUBA9_DLY2: Z7_FUNCTION1 (D1.C4), MY_beamControl_R电平转换 (U3.F5)
SUBA9_DLY_5V0: MY_beamControl_R_对内接口 (XS18.50), MY_beamControl_R电平转换 (U3.G2)
SUBA9_DLY_5V1: MY_beamControl_R_对内接口 (XS18.33), MY_beamControl_R电平转换 (U3.G1)
SUBA9_DLY_5V2: MY_beamControl_R_对内接口 (XS18.6), MY_beamControl_R电平转换 (U3.F2)
SUBA10_DLY0: Z7_FUNCTION1 (D1.A4), MY_beamControl_R电平转换 (U3.J6)
SUBA10_DLY1: Z7_FUNCTION1 (D1.A5), MY_beamControl_R电平转换 (U3.H5)
SUBA10_DLY2: Z7_FUNCTION1 (D1.B4), MY_beamControl_R电平转换 (U3.H6)
SUBA10_DLY_5V0: MY_beamControl_R_对内接口 (XS20.50), MY_beamControl_R电平转换 (U3.J1)
SUBA10_DLY_5V1: MY_beamControl_R_对内接口 (XS20.33), MY_beamControl_R电平转换 (U3.H2)
SUBA10_DLY_5V2: MY_beamControl_R_对内接口 (XS20.6), MY_beamControl_R电平转换 (U3.H1)
SUBA11_DLY0: Z7_FUNCTION1 (D1.B2), MY_beamControl_R电平转换 (U4.C5)
SUBA11_DLY1: Z7_FUNCTION1 (D1.C1), MY_beamControl_R电平转换 (U4.B6)
SUBA11_DLY2: Z7_FUNCTION1 (D1.C2), MY_beamControl_R电平转换 (U4.B5)
SUBA11_DLY_5V0: MY_beamControl_R_对内接口 (XS22.50), MY_beamControl_R电平转换 (U4.C2)
SUBA11_DLY_5V1: MY_beamControl_R_对内接口 (XS22.33), MY_beamControl_R电平转换 (U4.B1)
SUBA11_DLY_5V2: MY_beamControl_R_对内接口 (XS22.6), MY_beamControl_R电平转换 (U4.B2)
SUBA12_DLY0: Z7_FUNCTION1 (D1.A2), MY_beamControl_R电平转换 (U4.D6)
SUBA12_DLY1: Z7_FUNCTION1 (D1.A3), MY_beamControl_R电平转换 (U4.D5)
SUBA12_DLY2: Z7_FUNCTION1 (D1.B1), MY_beamControl_R电平转换 (U4.C6)
SUBA12_DLY_5V0: MY_beamControl_R_对内接口 (XS24.50), MY_beamControl_R电平转换 (U4.D1)
SUBA12_DLY_5V1: MY_beamControl_R_对内接口 (XS24.33), MY_beamControl_R电平转换 (U4.D2)
SUBA12_DLY_5V2: MY_beamControl_R_对内接口 (XS24.6), MY_beamControl_R电平转换 (U4.C1)
TX1: Z7_FUNCTION2 (D1.W23), MY_beamControl_R_对外接口 (D24.5)
UART0_RX: Z7_JTAG&DEBUG (CN17.2 R213.2 U7.25), Z7_BANK500_501 (D1.B22)
UART0_TX: Z7_JTAG&DEBUG (CN17.3 R214.2 U7.24), Z7_BANK500_501 (D1.C22)
USB0_CLK: Z7_USB (D20.1), Z7_BANK500_501 (D1.H17)
USB0_DATA0: Z7_USB (D20.3), Z7_BANK500_501 (D1.K17)
USB0_DATA1: Z7_USB (D20.4), Z7_BANK500_501 (D1.G22)
USB0_DATA2: Z7_USB (D20.5), Z7_BANK500_501 (D1.K18)
USB0_DATA3: Z7_USB (D20.6), Z7_BANK500_501 (D1.G21)
USB0_DATA4: Z7_USB (D20.7), Z7_BANK500_501 (D1.L17)
USB0_DATA5: Z7_USB (D20.9), Z7_BANK500_501 (D1.B21)
USB0_DATA6: Z7_USB (D20.10), Z7_BANK500_501 (D1.A20)
USB0_DATA7: Z7_USB (D20.13), Z7_BANK500_501 (D1.F18)
USB0_DIR: Z7_USB (D20.31), Z7_BANK500_501 (D1.H22)
USB0_NXT: Z7_USB (D20.2), Z7_BANK500_501 (D1.H21)
USB0_STP: Z7_USB (D20.29), Z7_BANK500_501 (D1.L18)
USB_REST: Z7_USB (D20.27 R351.1), Z7_FUNCTION1 (D1.H3)
VCC1V0_PG: POWER_B1 (D4.33 R90.2), POWER_B2 (D5.1)
VCC1V35_PG: POWER_B2 (D5.2 R96.2), POWER_B3 (D6.7)
VCC_5V_IN: POWER_B1 (15 pins), POWER_B2 (12 pins), POWER_B3 (C238.1 C242.1 D6.13 D6.14), MY_beamControl_R_组件电源分配 (36 pins), Z7_USB (C471.1 D21.7), Z7_FUNCTION3 (C339.2 C340.2 D13.8 D14.3), MY_beamControl_R_对外接口 (15 pins), MY_beamControl_R电平转换 (12 pins)
VCC_DDR_REF: Z7_BANK_DDR3 (31 pins), Z7_DDR3 (15 pins)
XADC_GND: A7_JTAG&CONFIG (11 pins), A7_JTAG&CONFIG - Ⅱ (11 pins), Z7_POWER2 (D1.P14), Z7_JTAG&DEBUG (11 pins)
Z7_A7_RESERVE1: A7_FUNCTION2 (D2.AH7), Z7_FUNCTION2 (D1.AA14)
Z7_A7_RESERVE2: A7_FUNCTION2 - Ⅱ (D3.AH6), Z7_FUNCTION2 (D1.AB22)
ZYNQ_POR_N: Z7_BANK500_501 (R140.1), Z7_FUNCTION1 (D1.L1 R328.2), ZYNQ_reset (D26.2)
ZYNQ_TDI_R: Z7_BLOCK (R216.1), Z7_JTAG&DEBUG (D1.P10 R211.2)
ZYNQ_TDO: Z7_BLOCK (R294.1), Z7_JTAG&DEBUG (D1.Y10 R210.2 R302.2)